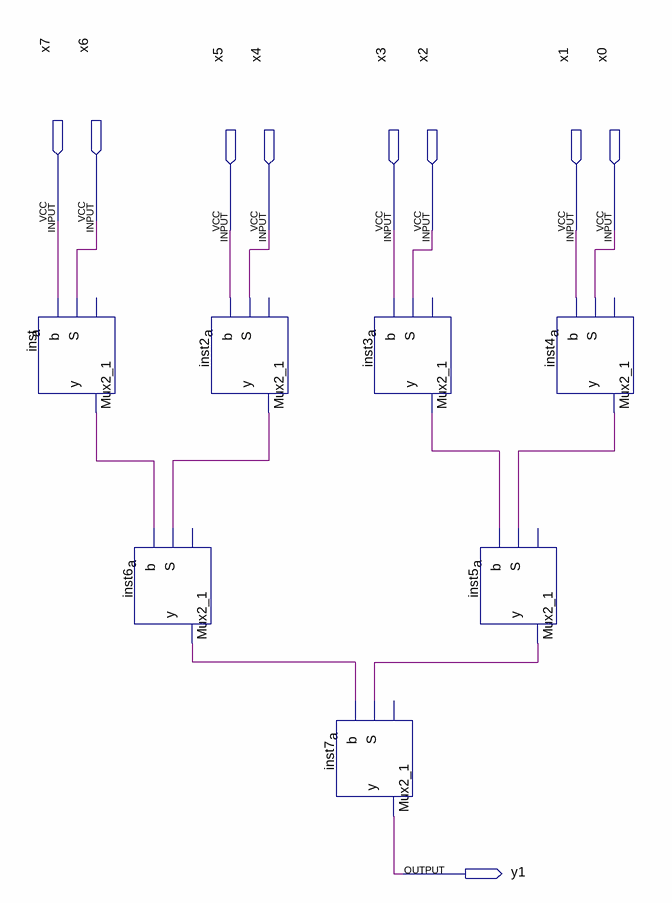
[diagram p0: schematic sheet]
// Quartus schematic Mux8_1.bdf as structural Verilog: 7 symbols, 9 pins
module Mux8_1 (
  input  x7,
  input  x6,
  input  x5,
  input  x4,
  input  x3,
  input  x2,
  input  x1,
  input  x0,
  output y1
);

  wire inst2_y, inst3_y, inst4_y, inst5_y, inst6_y, inst_y;

  Mux2_1 inst (.b(x6), .a(x7), .y(inst_y));  // open: S
  Mux2_1 inst6 (.b(inst2_y), .a(inst_y), .y(inst6_y));  // open: S
  Mux2_1 inst2 (.b(x4), .a(x5), .y(inst2_y));  // open: S
  Mux2_1 inst7 (.b(inst5_y), .a(inst6_y), .y(y1));  // open: S
  Mux2_1 inst3 (.b(x2), .a(x3), .y(inst3_y));  // open: S
  Mux2_1 inst5 (.b(inst4_y), .a(inst3_y), .y(inst5_y));  // open: S
  Mux2_1 inst4 (.b(x0), .a(x1), .y(inst4_y));  // open: S
endmodule
